# Altium schematic sheet Power.SchDoc
size A4; SheetNumber: 1; SheetTotal: 5; SPICEModelCacheEWVEJELR: <root> / <DocumentId>EWVEJELR</DocumentId> / <CacheFrame Number="0"> / <Model Name="865250140002_22uf" Kind="CKT"> / <Text>******* / .subckt 865250140002_22uF 1 2 / Rser 1 3 2.79274851491 / Lser 2 4 9.31010869E-10 / C1 3 4 0.000022 / Rpar 3 4 2100000 / .ends 865250140002_22uF</Text> / </Model> / <Model Name="865250240001_10uf" Kind="CKT"> / <Text>******* / .subckt 865250240001_10uF 1 2 / Rser 1 3 1.93839512911 / Lser 2 4 8.46868376E-10 / C1 3 4 0.00001 / Rpar 3 4 3333333.33333333 / .ends 865250240001_10uF</Text> / </Model> / </CacheFrame> / </root>
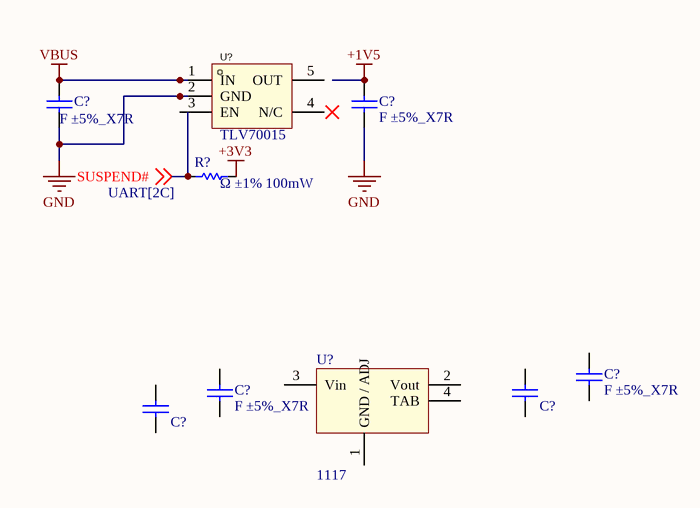
[diagram p0: Power.SchDoc]

## Parts
(Parts that share a designator on the sheet are numbered #1, #2 ... from top to bottom, then left to right.)
C?#1  F ±5%_X7R  [C0805]
C?#2  F ±5%_X7R  [C0805]
C?#3  F ±5%_X7R  [C0805]
C?#4  F ±5%_X7R  [C0805]
C?#5  22µF  [WCAP-ASNP_D4H5.5]  (value not drawn)
C?#6  10µF  [WCAP-ASNP_D4H5.5]  (value not drawn)
R?  Ω ±1% 100mW  [R0603]
U?#1  TLV70015  [SOT-23-5_L2.9-W1.6-P0.95-LS2.8-BR]
U?#2  1117  [SOT-223-3]

## Nets
+1V5: C?#2.2
+3V3: R?.1
GND: C?#1.1 C?#2.1 U?#1.2(GND)
VBUS: C?#1.2 U?#1.1(IN)
SUSPEND#: R?.2 ; off-sheet SUSPEND#

Not connected (* = marked no-connect by the designer): C?#3 1 2; C?#4 1 2; C?#5 1 2; C?#6 1 2; U?#1 3(EN) 4(N/C) 5(OUT); U?#2 1(GND_/_ADJ) 2(Vout) 3(Vin) 4(TAB)

## Library data of the parts
C?#1-C?#4 = Cap: Capacitor; Published: 8-Jun-2000; LatestRevisionDate: 17-Jul-2002; LatestRevisionNote: Re-released for DXP Platform.; PackageReference: RAD-0.3; Publisher: Altium Limited; PackageDescription: Radial Cap, Thru-Hole; 2 Leads; 0.3 in Pin Spacing
C?#5 = 865250140002: WCAP-ASNP Aluminum Electrolytic Capacitor, V-Chip, SMT, D4 x H5.5mm, 22µF, 6.3V; Manufacturer: Wurth Elektronik; Capacitance Tolerance: +/-20%; Dissipation Factor: 24%; Endurance: 2000h; Leakage Current: 10µA; Ripple Current: 28mA; Technical Reference: ASBB055220M6R3DVCTAB000; Manufacturer Part Number: 865250140002; Category: Aluminum Electrolytic Capacitors; Match Code: WCAP-ASNP; ComponentLink1Description: Website Link; ComponentLink1URL: https://www.we-online.com/redexpert/article/865250140002?ad; ComponentLink2Description: Datasheet Link; ComponentLink2URL: https://www.we-online.com/redexpert/spec/865250140002?ad; Mount: Surface Mount; Operating Temperature Max: 85°C; Operating Temperature Min: -40°C; Packaging: Tape and Reel; Case/Size Code: D4 x H5.5mm; Height: 5.5mm; Diameter: 4mm; Capacitance: 22µF; Rated Voltage (DC): 6.3V
C?#6 = 865250240001: WCAP-ASNP Aluminum Electrolytic Capacitor, V-Chip, SMT, D4 x H5.5mm, 10µF, 10V; Manufacturer: Wurth Elektronik; Capacitance Tolerance: +/-20%; Dissipation Factor: 20%; Endurance: 2000h; Leakage Current: 10µA; Ripple Current: 17mA; Technical Reference: ASBB055100M010DVCTAB000; Manufacturer Part Number: 865250240001; Category: Aluminum Electrolytic Capacitors; Match Code: WCAP-ASNP; ComponentLink1Description: Website Link; ComponentLink1URL: https://www.we-online.com/redexpert/article/865250240001?ad; ComponentLink2Description: Datasheet Link; ComponentLink2URL: https://www.we-online.com/redexpert/spec/865250240001?ad; Mount: Surface Mount; Operating Temperature Max: 85°C; Operating Temperature Min: -40°C; Packaging: Tape and Reel; Case/Size Code: D4 x H5.5mm; Height: 5.5mm; Diameter: 4mm; Capacitance: 10µF; Rated Voltage (DC): 10V
R? = Res: Resistor; Published: 8-Jun-2000; LatestRevisionDate: 17-Jul-2002; LatestRevisionNote: Re-released for DXP Platform.; PackageReference: AXIAL-0.3; Publisher: Altium Limited; PackageDescription: Axial Device, Thru-Hole; 2 Leads; 0.3 in Pin Spacing
U?#1 = TLV70015: Manufacturer: TI(德州仪器); Name: TLV70015DDCR; Add into BOM: yes; Output Type: 固定; Output Polarity: 正; Number of Outputs: 1; Maximum Input Voltage: 5.5V; Output Voltage: 1.5V; Dropout Voltage: 250mV@(200mA); Quiescent Current (Ground Current): 55uA; Output Current: 200mA; Power Supply Rejection Ratio (PSRR): 68dB@(1kHz); Symbol: TLV70015DDCR; Device: TLV70015DDCR; LCSC Part Name: TLV70015DDCR; Supplier Part: C2865100; Manufacturer Part: TLV70015DDCR; Supplier Footprint: SOT-23-Thin-5; JLCPCB Part Class: Extended Part; Datasheet: https://atta.szlcsc.com/upload/public/pdf/source/20230221/CBA3FAF2ECD8317094AE1D26AA0CA23B.pdf; Supplier: LCSC; Convert to PCB: yes; Operating Temperature: -40℃~+125℃@(Tj)